# Altium schematic sheet Alimentacion.V03.R00.SchDoc: Alimentación y Filtros
size A4; SheetNumber: 15; SheetTotal: 18
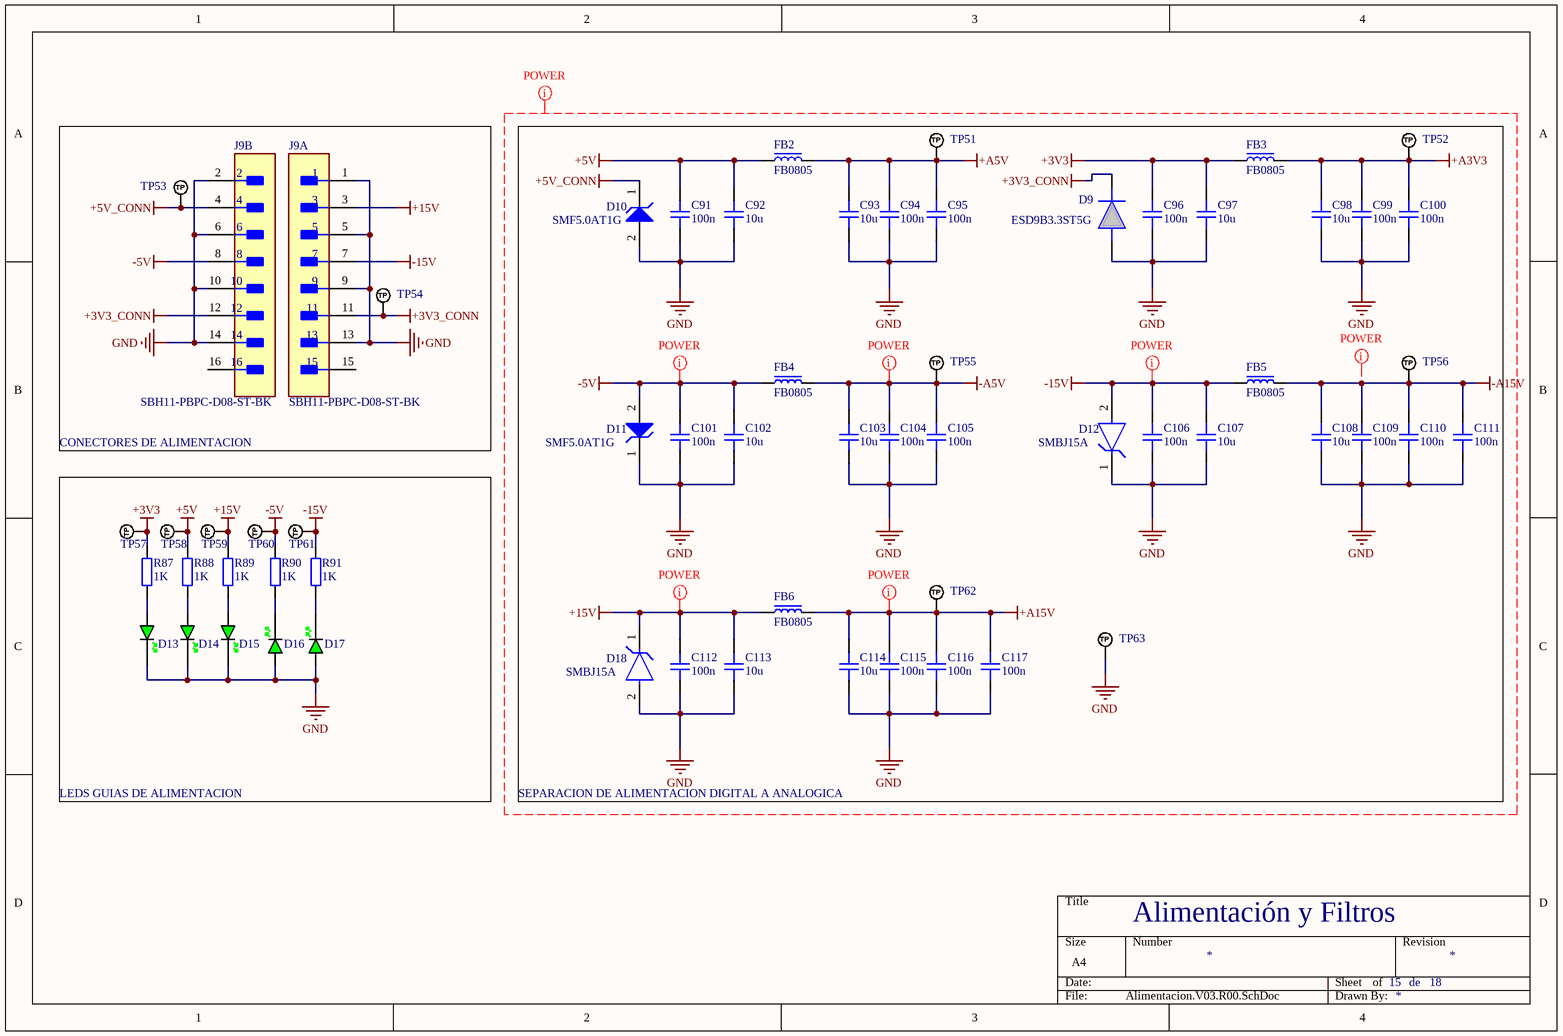
[diagram p0: Alimentacion.V03.R00.SchDoc]

## Parts
C91  100n  [CAP_0805]
C92  10u  [CAP_0805]
C93  10u  [CAP_0805]
C94  100n  [CAP_0805]
C95  100n  [CAP_0805]
C96  100n  [CAP_0805]
C97  10u  [CAP_0805]
C98  10u  [CAP_0805]
C99  100n  [CAP_0805]
C100  100n  [CAP_0805]
C101  100n  [CAP_0805]
C102  10u  [CAP_0805]
C103  10u  [CAP_0805]
C104  100n  [CAP_0805]
C105  100n  [CAP_0805]
C106  100n  [CAP_0805]
C107  10u  [CAP_0805]
C108  10u  [CAP_0805]
C109  100n  [CAP_0805]
C110  100n  [CAP_0805]
C111  100n  [CAP_0805]
C112  100n  [CAP_0805]
C113  10u  [CAP_0805]
C114  10u  [CAP_0805]
C115  100n  [CAP_0805]
C116  100n  [CAP_0805]
C117  100n  [CAP_0805]
D9  ESD9B3.3ST5G  [SODFL1006X40N]
D10  SMF5.0AT1G  [ONSC-SOD-123FL-2-498_V]
D11  SMF5.0AT1G  [ONSC-SOD-123FL-2-498_V]
D12  SMBJ15A  [FP-SMBJ-MFG]
D13  GREEN  [LED_0805_GREEN]  (value not drawn)
D14  GREEN  [LED_0805_GREEN]  (value not drawn)
D15  GREEN  [LED_0805_GREEN]  (value not drawn)
D16  GREEN  [LED_0805_GREEN]  (value not drawn)
D17  GREEN  [LED_0805_GREEN]  (value not drawn)
D18  SMBJ15A  [FP-SMBJ-MFG]
FB2  FB0805  [FB_0805]
FB3  FB0805  [FB_0805]
FB4  FB0805  [FB_0805]
FB5  FB0805  [FB_0805]
FB6  FB0805  [FB_0805]
J9  SBH11-PBPC-D08-ST-BK  [FP-SBH11-PBPC-D08-ST-BK-MFG]  (parts A,B of 2)
R87  1K  [RES_0805]
R88  1K  [RES_0805]
R89  1K  [RES_0805]
R90  1K  [RES_0805]
R91  1K  [RES_0805]
TP51  TP_NOBOM  [PAD_RND_1MM]  (value not drawn)  (no BOM)
TP52  TP_NOBOM  [PAD_RND_1MM]  (value not drawn)  (no BOM)
TP53  TP_NOBOM  [PAD_RND_1MM]  (value not drawn)  (no BOM)
TP54  TP_NOBOM  [PAD_RND_1MM]  (value not drawn)  (no BOM)
TP55  TP_NOBOM  [PAD_RND_1MM]  (value not drawn)  (no BOM)
TP56  TP_NOBOM  [PAD_RND_1MM]  (value not drawn)  (no BOM)
TP57  TP_NOBOM  [PAD_RND_1MM]  (value not drawn)  (no BOM)
TP58  TP_NOBOM  [PAD_RND_1MM]  (value not drawn)  (no BOM)
TP59  TP_NOBOM  [PAD_RND_1MM]  (value not drawn)  (no BOM)
TP60  TP_NOBOM  [PAD_RND_1MM]  (value not drawn)  (no BOM)
TP61  TP_NOBOM  [PAD_RND_1MM]  (value not drawn)  (no BOM)
TP62  TP_NOBOM  [PAD_RND_1MM]  (value not drawn)  (no BOM)
TP63  TP_NOBOM  [PAD_RND_1MM]  (value not drawn)  (no BOM)

## Blocks framed on the sheet
CONECTORES DE ALIMENTACION: J9 TP53 TP54
SEPARACION DE ALIMENTACION DIGITAL A ANALOGICA: C91-C117 D9-D12 D18 FB2-FB6 TP51 TP52 TP55 TP56 TP62 TP63
LEDS GUIAS DE ALIMENTACION: D13-D17 R87-R91 TP57-TP61

## Nets
+3V3: C96.1 C97.1 FB3.1 R87.2 TP57.1(TP)
+3V3_CONN: D9.1(K) J9.11 J9.12 TP54.1(TP)
+5V: C91.1 C92.1 FB2.1 R88.2 TP58.1(TP)
+5V_CONN: D10.1(K) J9.4 TP53.1(TP)
+15V: C112.1 C113.1 D18.1(C) FB6.1 J9.3 R89.2 TP59.1(TP)
+A3V3: C98.1 C99.1 C100.1 FB3.2 TP52.1(TP)
+A5V: C93.1 C94.1 C95.1 FB2.2 TP51.1(TP)
+A15V: C114.1 C115.1 C116.1 C117.1 FB6.2 TP62.1(TP)
-5V: C101.1 C102.1 D11.2(A) FB4.1 J9.8 R90.2 TP60.1(TP)
-15V: C106.1 C107.1 D12.2(A) FB5.1 J9.7 R91.2 TP61.1(TP)
-A5V: C103.1 C104.1 C105.1 FB4.2 TP55.1(TP)
-A15V: C108.1 C109.1 C110.1 C111.1 FB5.2 TP56.1(TP)
GND: C91.2 C92.2 C93.2 C94.2 C95.2 C96.2 C97.2 C98.2 C99.2 C100.2 C101.2 C102.2 C103.2 C104.2 C105.2 C106.2 C107.2 C108.2 C109.2 C110.2 C111.2 C112.2 C113.2 C114.2 C115.2 C116.2 C117.2 D9.2(A) D10.2(A) D11.1(K) D12.1(C) D13.K D14.K D15.K D16.A D17.A D18.2(A) J9.1 J9.2 J9.5 J9.6 J9.9 J9.10 J9.13 J9.14 TP63.1(TP)
NetD13_A: D13.A R87.1
NetD14_A: D14.A R88.1
NetD15_A: D15.A R89.1
NetD16_K: D16.K R90.1
NetD17_K: D17.K R91.1

Not connected (* = marked no-connect by the designer): J9 15 16

## Layout directives
net class Power; rule Width Constraint [Pref Width = 0.5mm    Min Width = 0.2mm    Max Width = 1mm]: +3V3, +3V3_CONN, +5V, +5V_CONN, +15V, +A3V3, +A5V, +A15V, -5V, -15V, -A5V, -A15V, GND
net class POWER; rule Width Constraint [Pref Width = 0.5mm    Min Width = 0.2mm    Max Width = 1mm]; rule Routing Via Style [Pref Size = 1.27mm    Pref Hole Size = 0.711mm]; rule Clearance Constraint [Clearance = 0.2mm]; rule Polygon Connect Style [Style - Direct Connect]: +3V3, +3V3_CONN, +5V, +5V_CONN, +15V, +A3V3, +A5V, +A15V, -5V, -15V, -A5V, -A15V, GND

## Notes on the sheet
- de

## Library data of the parts
C91-C117 = CAP_0805: Capacitor SMD 0805; Manufacturer: *; Manufacturer Part Number: *; Distributor Link: *; LCSC: *; Rating: *; Dielectric: *
D9 = ESD9B3.3ST5G: SZ Prefix for Automotive and Other Applications Requiring Unique Site and Control Change Requirements ; AECQ101 Qualified and PPAP Capable ; This is a PbFree Device; Low Capacitance 15 pF; Low Clamping Voltage; Small Body Outline Dimensions: 0.039 x 0.024 (1.0mm x 0.60mm); Low Body Height: 0.016 (0.4 mm); Response Time is < 1 ns; IEC6100042 Level 4 ESD Protection; Low Leakage; Manufacturer_Name: onsemi; Geometry.Height: 0.4mm; Mouser Part Number: 863-ESD9B3.3ST5G; Mouser Price/Stock: https://www.mouser.co.uk/ProductDetail/onsemi/ESD9B3.3ST5G?qs=yU2N9dt%252BrfmXrPf3vhgUEA%3D%3D; Manufacturer_Part_Number: ESD9B3.3ST5G; Datasheet Link: https://www.onsemi.com/pub/Collateral/ESD9B-D.PDF
D10 D11 = CMP-1061-00612-1: 200 W Transient Voltage Suppressor, 2-Pin SOD-123FL, Pb-Free, Tape and Reel; Manufacturer: On Semiconductor; Direction: Unidirectional; IR Max (uA): 400; V(BR) Typ (V): 6.7; PackageDescription: 2-Pin SOD, Body 1.65 x 2.7 mm; PartNumber: SMF5.0AT1G; ComponentLink3Description: Package Specification; ComponentLink3URL: http://www.onsemi.com/pub_link/Collateral/498-01.PDF; PackageVersion: Rev. D, 05/2013; Mounting Technology: Surface Mount; PackageReference: SOD-123FL-2-498; ComponentLink2URL: http://www.onsemi.com/pub_link/Collateral/SMF5.0AT1-D.PDF; DatasheetVersion: Rev. 7; ComponentLink1Description: Manufacturer URL; Packing: Tape and Reel; RoHS: Pb-Free; ComponentLink1URL: http://www.onsemi.com/; ComponentLink2Description: Datasheet
D12 D18 = CMP-07401-000033-1: TVS DIODE 15VWM 24.4VC SMB; Max Breakdown Voltage: 19.2V; Reverse Standoff Voltage: 15V; Number of Elements: 1; Diode Type: ZENER; Max Reverse Leakage Current: 5uA; Operating Supply Voltage: 3.5V; Element Configuration: Single; Reverse Breakdown Voltage: 16.7V; Peak Pulse Power: 600W; Peak Pulse Current: 24A; Polarity: Unidirectional; Clamping Voltage: 24.4V; ESD Protection: Yes; Test Current: 1mA; Power Line Protection: No; Max Surge Current: 100A; Min Operating Temperature: -55°C; Number of Pins: 2; Case/Package: DO-214AA; Number of Channels: 1; Series: SMBJ; Height: 2.42mm; Resistor Type: Zener; Max Power Dissipation: 600W; REACH SVHC: No SVHC; Package Quantity: 1; Breakdown Voltage: 19.2V; Radiation Hardening: No; Direction: Unidirectional; Number of Unidirectional Channels: 1; Termination: SMD/SMT; Length: 4.57mm; Width: 3.94mm; Packaging: Tape and Reel; Leakage Current: 5uA; RoHS Compliant: Yes; Mount: Surface Mount; Min Breakdown Voltage: 16.7V; Max Operating Temperature: 150°C
D13-D17 = LED_0805_GREEN: LED 0805 GREEN SMD; Manufacturer: *; Manufacturer Part Number: *; Distributor Link: *; LCSC: *
FB2-FB6 = FB_0805: Ferrite Bead SMD 0805; Manufacturer: *; Manufacturer Part Number: *; Distributor Link: *; LCSC: *
J9 = CMP-25680-000019-1: CONN HEADER VERT 16POS 2.54MM; Manufacturer: Sullins; Current Rating: 3A; Conn Gender: Male; Conn Orientation: Straight; Standoff Height: 0.3mm; Number Of Contacts: 16; Temperature: -40°C to +105°C; Digikey Description: CONN HEADER VERT 16POS 2.54MM; Contact Material: Gold,Nickel; Temperature Range High: +105°C; Package: 0; Octopart: https://octopart.com/sbh11-pbpc-d08-st-bk-sullins-12270491; Category: Conn; Automotive: No; Lead Free: Yes; ComponentLink2Description: Datasheet; Device Class L1: Connectors; Number Of Rows: 2; ComponentLink2URL: https://drawings-pdf.s3.amazonaws.com/11091.pdf; RoHS: TRUE; Height: 9.3mm; Pitch: 2.54mm; Temperature Range Low: -40°C; Device Class L2: Headers and Wire Housings; Manufacturer Part Number: SBH11-PBPC-D08-ST-BK; Device Class L3: unset
R87-R91 = RES_0805: Resistor SMD 0805; Manufacturer: *; Manufacturer Part Number: *; Distributor Link: *; LCSC: *
TP51-TP63 = TEST_POINT_RND_1MM: Test Point Round 1mm (NO BOM)